# Altium schematic sheet POW.SchDoc
size A4
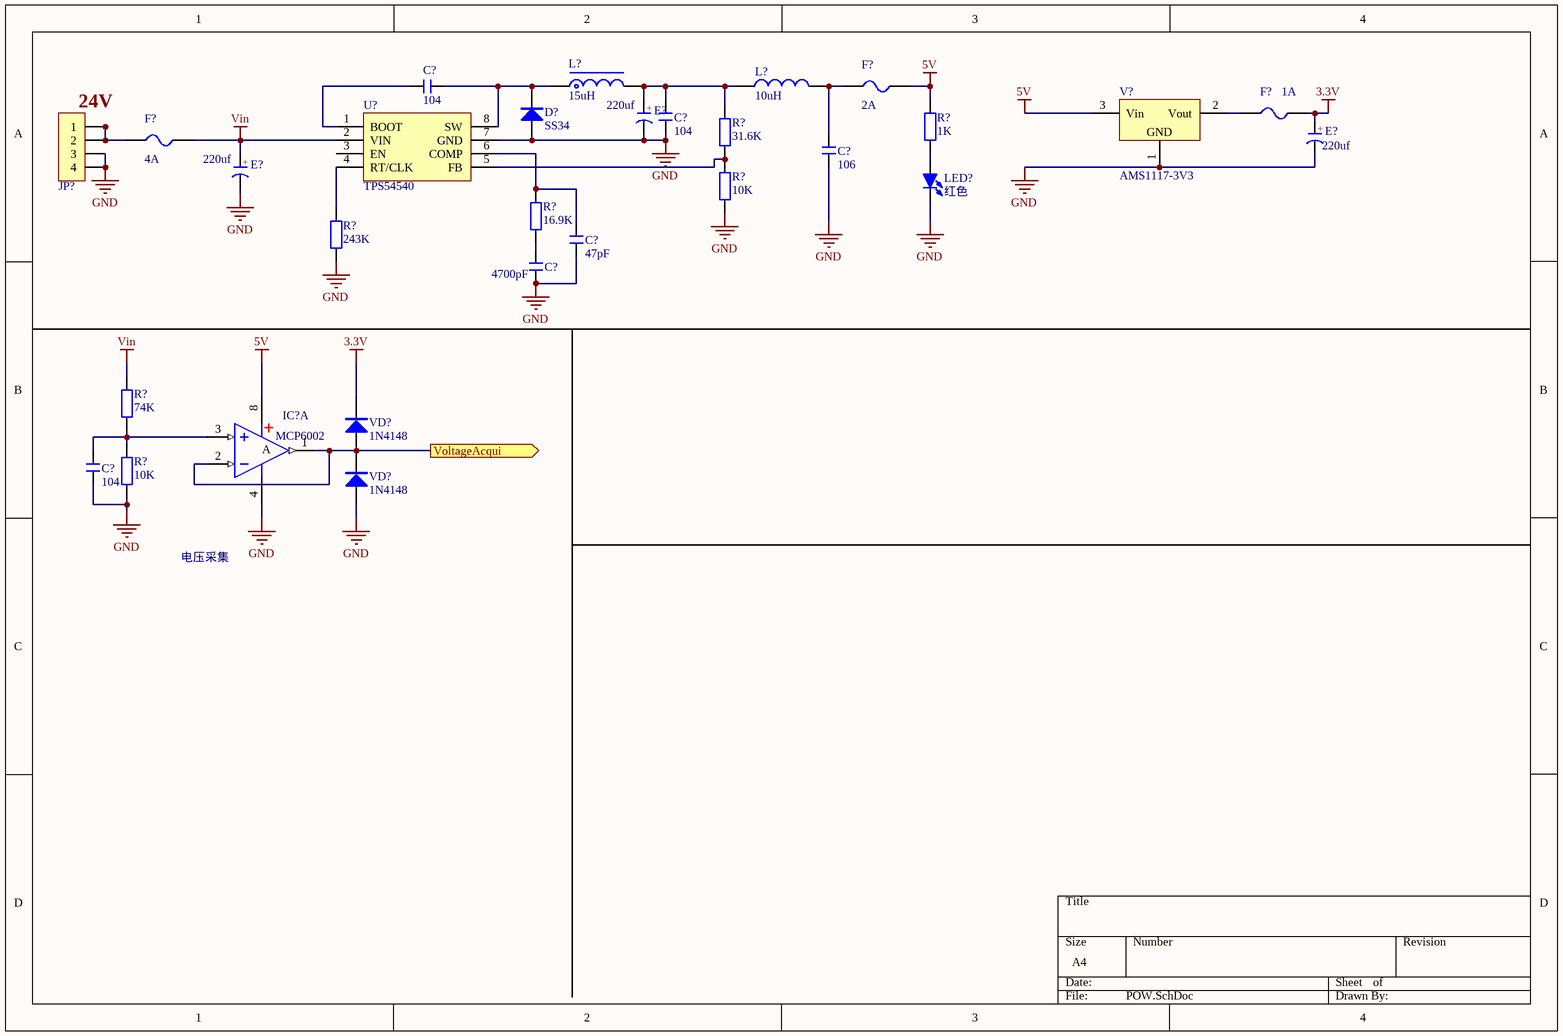
[diagram p0: POW.SchDoc]

## Parts
(Parts that share a designator on the sheet are numbered #1, #2 ... from top to bottom, then left to right.)
C?#1  104  [C 0603_L]
C?#2  104  [C 0603_L]
C?#3  106  [C 0603_L]
C?#4  47pF  [C 0603_L]
C?#5  4700pF  [C 0603_L]
C?#6  104  [C 0603]
D?  SS34  [SMC]
E?#1  220uf  [CM E(8*10.2)]
E?#2  220uf  [CM E(8*10.2)]
E?#3  220uf  [CM E(8*10.2)]
F?#1  2A  [FU 1206]
F?#2  1A  [FU 0805]
F?#3  4A  [FU 1206]
IC?  MCP6002  [SOP8_N]  (part A of 2)
JP?  HDR-1X4  [XH2.54-LI-4P]  (value not drawn)
L?#1  15uH  [CDRH73]
L?#2  10uH  [L 0805]
LED?  红色  [LED 0603R]
R?#1  1K  [R 0603_L]
R?#2  31.6K  [R 0603_L]
R?#3  10K  [R 0603_L]
R?#4  16.9K  [R 0603_L]
R?#5  243K  [R 0603_L]
R?#6  74K  [R 0603_L]
R?#7  10K  [R 0603_L]
U?  TPS54540  [SOP8_1]
V?  AMS1117-3V3  [SOT223_M]
VD?#1  1N4148  [SOD-323]
VD?#2  1N4148  [SOD-323]

## Ports
VoltageAcqui (out)

## Nets
3.3V: E?#2.1(A) F?#2.2 VD?#1.2(K)
5V: F?#1.2 IC?.8(V+) R?#1.2 V?.3(Vin)
GND: C?#2.1 C?#3.1 C?#4.1 C?#5.1 C?#6.1 D?.1(A) E?#1.2(K) E?#2.2(K) E?#3.2(K) IC?.4(V-) JP?.3 JP?.4 LED?.2(K) R?#3.1 R?#5.1 R?#7.1 U?.7(GND) V?.1(GND) VD?#2.1(A)
Vin: E?#3.1(A) F?#3.2 R?#6.2 U?.2(VIN)
VoltageAcqui: IC?.1(OUT) IC?.2(IN-) VD?#1.1(A) VD?#2.2(K) ; port VoltageAcqui
NetC?#1_1: C?#1.1 U?.1(BOOT)
NetC?#1_2: C?#1.2 D?.2(K) L?#1.1 U?.8(SW)
NetC?#2_2: C?#2.2 E?#1.1(A) L?#1.2 L?#2.1 R?#2.2
NetC?#3_2: C?#3.2 F?#1.1 L?#2.2
NetC?#4_2: C?#4.2 R?#4.2 U?.6(COMP)
NetC?#5_2: C?#5.2 R?#4.1
NetC?#6_2: C?#6.2 IC?.3(IN+) R?#6.1 R?#7.2
NetF?#2_1: F?#2.1 V?.2(Vout)
NetF?#3_1: F?#3.1 JP?.1 JP?.2
NetLED?_1: LED?.1(A) R?#1.1
NetR?#2_1: R?#2.1 R?#3.2 U?.5(FB)
NetR?#5_2: R?#5.2 U?.4(RT/CLK)

Not connected (* = marked no-connect by the designer): U? 3(EN)

## Notes on the sheet
- (near JP?) 24V
- 电压采集
- (in symbol C-CM) +
- (in symbol LM358, part A) A

## Library data of the parts
C?#1-C?#6 = C: 无极性贴片电容; 版权归属: 源创客; BOM名称: 无极性贴片电容; 学习资源: www.ooocke.com
D? = SS34: 肖特基二极管; 版权归属: 源创客; 属性: 40V/3A; BOM名称: 肖特基二极管; 学习资源: www.ooocke.com
E?#1-E?#3 = C-CM: 贴片电解电容; 版权归属: 源创客; BOM名称: 贴片电解电容; 学习资源: www.ooocke.com
F?#1-F?#3 = FU: 贴片保险丝; 版权归属: 源创客; BOM名称: 贴片保险丝; 学习资源: www.ooocke.com
IC? = LM358: 双路运放; 版权归属: 源创客; BOM名称: 双路运放; 学习资源: www.ooocke.com
JP? = Header 4: 4P接插件; 版权归属: 源创客; BOM名称: 4P接插件; 学习资源: www.ooocke.com
L?#1 = L-CDRH: 功率屏蔽电感; 版权归属: 源创客; BOM名称: 功率屏蔽电感; 学习资源: www.ooocke.com
L?#2 = L: 小功率贴片电感; 版权归属: 源创客; BOM名称: 小功率贴片电感; 学习资源: www.ooocke.com
LED? = LED-SMD: 贴片LED; 版权归属: 源创客; BOM名称: 贴片LED; 学习资源: www.ooocke.com
R?#1-R?#7 = R: 贴片电阻; 版权归属: 源创客; BOM名称: 贴片电阻; 学习资源: www.ooocke.com
V? = AMS1117: 三端稳压芯片; BOM名称: 稳压芯片; 版权归属: 源创客; 学习资源: www.ooocke.com
VD?#1 VD?#2 = 1N4148: 高速开关二极管; 版权归属: 源创客; BOM名称: 高速开关二极管; 学习资源: www.ooocke.com